# EAGLE design odbiornik (EAGLE 6.4)
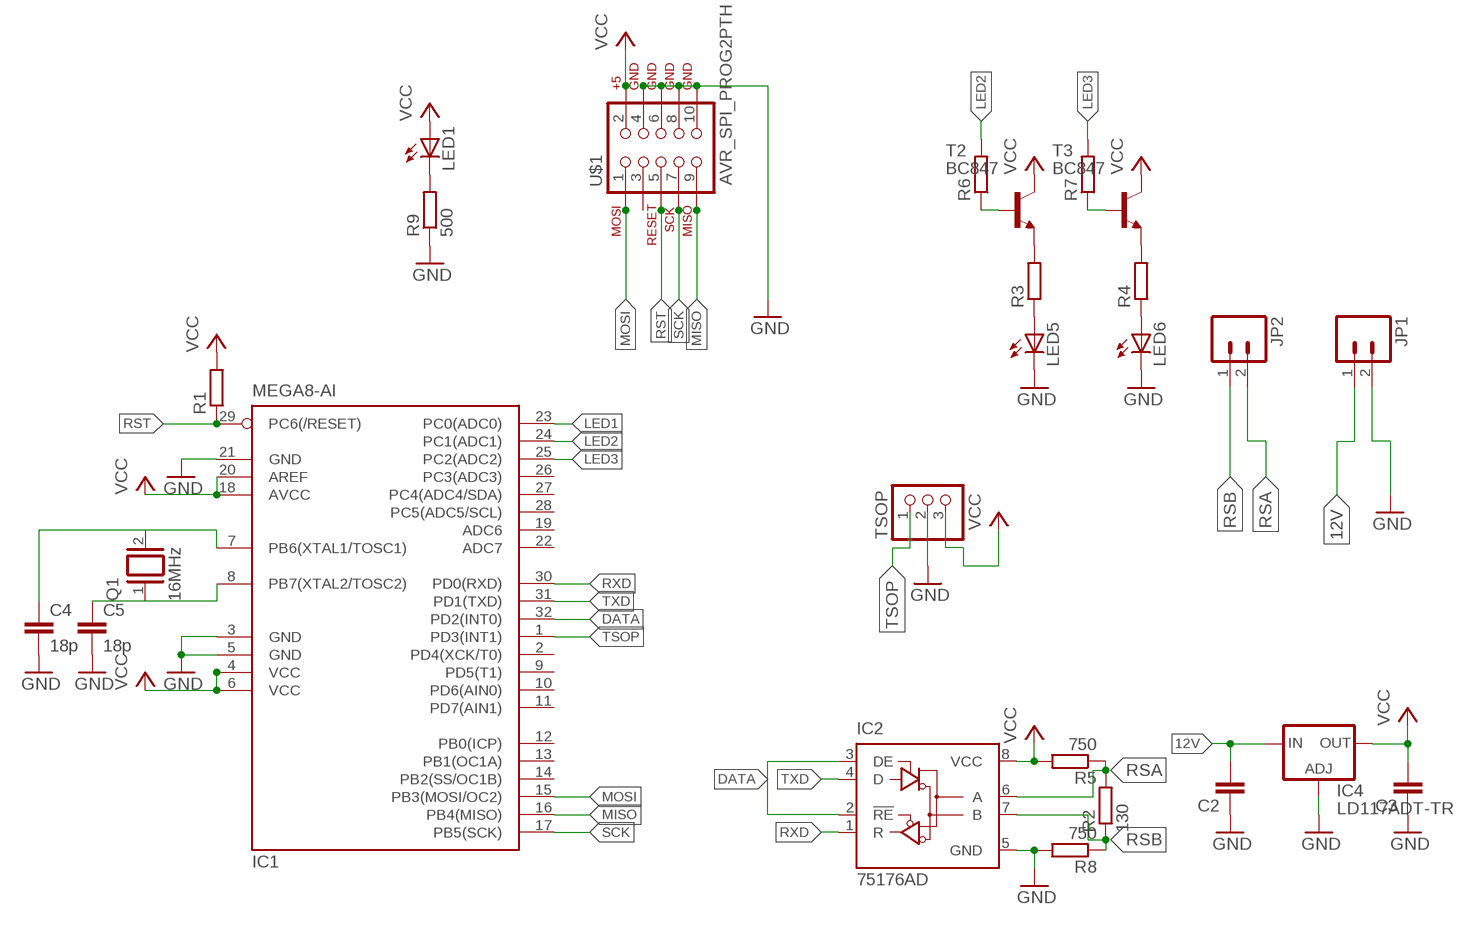
[diagram p0: schematic, sheet 1]

## Parts
C2  C-EUC0805  [C0805]
C3  C-EUC0805  [C0805]
C4  18p  C-EUC0805  [C0805]
C5  18p  C-EUC0805  [C0805]
IC1  MEGA8-AI  [TQFP32-08]
IC2  75176AD  [D_R-PDSO-G8]
IC4  LD117ADT-TR  [DPACK]
JP1  M02LOCK_LONGPADS  [1X02_LOCK_LONGPADS]
JP2  M02LOCK_LONGPADS  [1X02_LOCK_LONGPADS]
LED1  LED1206  [LED-1206]
LED5  LEDSFH480  [SFH480]
LED6  LEDSFH480  [SFH480]
Q1  16MHz  XTAL/S  [QS]
R1  R-EU_R0805  [R0805]
R2  130  R-EU_R0805  [R0805]
R3  R-EU_R0805  [R0805]
R4  R-EU_R0805  [R0805]
R5  750  R-EU_R0805  [R0805]
R6  R-EU_R0805  [R0805]
R7  R-EU_R0805  [R0805]
R8  750  R-EU_R0805  [R0805]
R9  500  R-EU_R0805  [R0805]
T2  BC847  [SOT23]
T3  BC847  [SOT23]
TSOP  PINHD-1X3  [1X03]
U$1  AVR_SPI_PROG2PTH  [AVR_ICSP]

## Nets
12V: C2.2 IC4.3(IN) JP1.1
DATA: IC1.32(PD2(INT0)) IC2.2(!RE) IC2.3(DE)
GND: C2.1 C3.1 C4.2 C5.2 IC1.3(GND) IC1.5(GND) IC1.21(GND) IC2.5(GND) IC4.1(ADJ) JP1.2 LED5.K(C) LED6.K(C) R8.2 R9.1 TSOP.2 U$1.4 U$1.6 U$1.8 U$1.10
LED1: IC1.23(PC0(ADC0))
LED2: IC1.24(PC1(ADC1)) R6.2
LED3: IC1.25(PC2(ADC2)) R7.2
MISO: IC1.16(PB4(MISO)) U$1.9
MOSI: IC1.15(PB3(MOSI/OC2)) U$1.1
N$1: LED1.C R9.2
N$3: LED5.A R3.1
N$4: LED6.A R4.1
N$5: R3.2 T2.2(E)
N$6: R4.2 T3.2(E)
N$8: R6.1 T2.1(B)
N$9: R7.1 T3.1(B)
N$10: C5.1 IC1.8(PB7(XTAL2/TOSC2)) Q1.1
N$11: C4.1 IC1.7(PB6(XTAL1/TOSC1)) Q1.2
RSA: IC2.6(A) JP2.2 R2.2 R5.1
RSB: IC2.7(B) JP2.1 R2.1 R8.1
RST: IC1.29(PC6(/RESET)) R1.1 U$1.5
RXD: IC1.30(PD0(RXD)) IC2.1(R)
SCK: IC1.17(PB5(SCK)) U$1.7
TSOP: IC1.1(PD3(INT1)) TSOP.1
TXD: IC1.31(PD1(TXD)) IC2.4(D)
VCC: C3.2 IC1.4(VCC) IC1.6(VCC) IC1.18(AVCC) IC1.20(AREF) IC2.8(VCC) IC4.4(OUT) LED1.A R1.2 R5.2 T2.3(C) T3.3(C) TSOP.3 U$1.2
Unconnected: IC1.2(PD4(XCK/T0)) IC1.9(PD5(T1)) IC1.10(PD6(AIN0)) IC1.11(PD7(AIN1)) IC1.12(PB0(ICP)) IC1.13(PB1(OC1A)) IC1.14(PB2(SS/OC1B)) IC1.19(ADC6) IC1.22(ADC7) IC1.26(PC3(ADC3)) IC1.27(PC4(ADC4/SDA)) IC1.28(PC5(ADC5/SCL)) U$1.3

## Library data of the parts
C2-C5 = rcl:C-EU: CAPACITOR, European symbol
IC1 = atmel:MEGA8: MICROCONTROLLER 8 Kbytes FLASH, 1 kbytes SRAM, 512 bytes EEPROM, USART, 6-channel 10 bit ADC, 2-channel 8 bit ADC Pin compatible with Atmega48, ATMega88, ATMega168 Source: avr.lbr; MPN: ATMEGA8-16AU; OC_FARNELL: 9171371; OC_NEWARK: 73M8863
IC2 = 751xx:75176A: DIFFERENTIAL BUS TRANSCEIVER Source: http://focus.ti.com/lit/ds/symlink/sn75176a.pdf
IC4 = v-reg:LD117A?*: Low drop fixed and adjustable positive voltage regulators 1 A Source: http://www.st.com/stonline/products/literature/ds/7194/ld1117axx.pdf
JP1 JP2 = SparkFun-Connectors:M02: Header 2 Standard 2-pin 0.1" header. Use with straight break away headers (SKU : PRT-00116), right angle break away headers (PRT-00553), swiss pins (PRT-00743), machine pins (PRT-00117), and female headers (PRT-00115). Molex polarized connector foot print use with SKU : PRT-08233 with associated crimp pins and housings.
LED1 = SparkFun-LED:LED: LEDs Standard schematic elements and footprints for 5mm, 3mm, 1206, and 0603 sized LEDs. 5mm - Spark Fun Electronics SKU : COM-00529 (and others)
LED5 LED6 = led:LED: LED OSRAM: - CHIPLED LG R971, LG N971, LY N971, LG Q971, LY Q971, LO R971, LY R971 LH N974, LH R974 LS Q976, LO Q976, LY Q976 LO Q996 - Hyper CHIPLED LW Q18S LB Q993, LB Q99A, LB R99A - SideLED LS A670, LO A670, LY A670, LG A670, LP A670 LB A673, LV A673, LT A673, LW A673 LH A674 LY A675 LS A676, LA A676, LO A676, LY A676, LW A676 LS A679, LY A679, LG A679 - Hyper Micro SIDELED® LS Y876, LA Y876, LO Y876, LY Y876 LT Y87S - SmartLED LW L88C, LW L88S LB L89C, LB L89S, LG L890 LS L89K, LO L89K, LY L89K LS L896, LA L896, LO L896, LY L896 - TOPLED LS T670, LO T670, LY T670, LG T670, LP T670 LSG T670, LSP T670, LSY T670, LOP T670, LYG T670 LG T671, LOG T671, LSG T671 LB T673, LV T673, LT T673, LW T673 LH T674 LS T676, LA T676, LO T676, LY T676, LB T676, LH T676, LSB T676, LW T676 LB T67C, LV T67C, LT T67C, LS T67K, LO T67K, LY T67K, LW E67C LS E67B, LA E67B, LO E67B, LY E67B, LB E67C, LV E67C, LT E67C LW T67C LS T679, LY T679, LG T679 LS T770, LO T770, LY T770, LG T770, LP T770 LB T773, LV T773, LT T773, LW T773 LH T774 LS E675, LA E675, LY E675, LS T675 LS T776, LA T776, LO T776, LY T776, LB T776 LHGB T686 LT T68C, LB T68C - Hyper Mini TOPLED® LB M676 - Mini TOPLED Santana® LG M470 LS M47K, LO M47K, LY M47K Source: http://www.osram.convergy.de LUXEON: - LUMILED® LXK2-PW12-R00, LXK2-PW12-S00, LXK2-PW14-U00, LXK2-PW14-V00 LXK2-PM12-R00, LXK2-PM12-S00, LXK2-PM14-U00 LXK2-PE12-Q00, LXK2-PE12-R00, LXK2-PE12-S00, LXK2-PE14-T00, LXK2-PE14-U00 LXK2-PB12-K00, LXK2-PB12-L00, LXK2-PB12-M00, LXK2-PB14-N00, LXK2-PB14-P00, LXK2-PB14-Q00 LXK2-PR12-L00, LXK2-PR12-M00, LXK2-PR14-Q00, LXK2-PR14-R00 LXK2-PD12-Q00, LXK2-PD12-R00, LXK2-PD12-S00 LXK2-PH12-R00, LXK2-PH12-S00 LXK2-PL12-P00, LXK2-PL12-Q00, LXK2-PL12-R00 Source: www.luxeon.com KINGBRIGHT: KA-3528ASYC Source: www.kingbright.com
Q1 = special:XTAL/S: CRYSTAL
R1-R9 = rcl:R-EU_: RESISTOR, European symbol
T2 T3 = transistor:BC847: NPN TRANSISTOR
TSOP = pinhead:PINHD-1X3: PIN HEADER
U$1 = SparkFun-Connectors:AVR_SPI_PROG2: AVR 10-pin ICSP Header This is the standard AVR In Circuit Serial Programming header. Minimal, but includes pin one indicator. Works with standard Olimex programmers. Also look for the 6-pin reduced version. Spark Fun Electronics SKU: PRT-00778

## Board
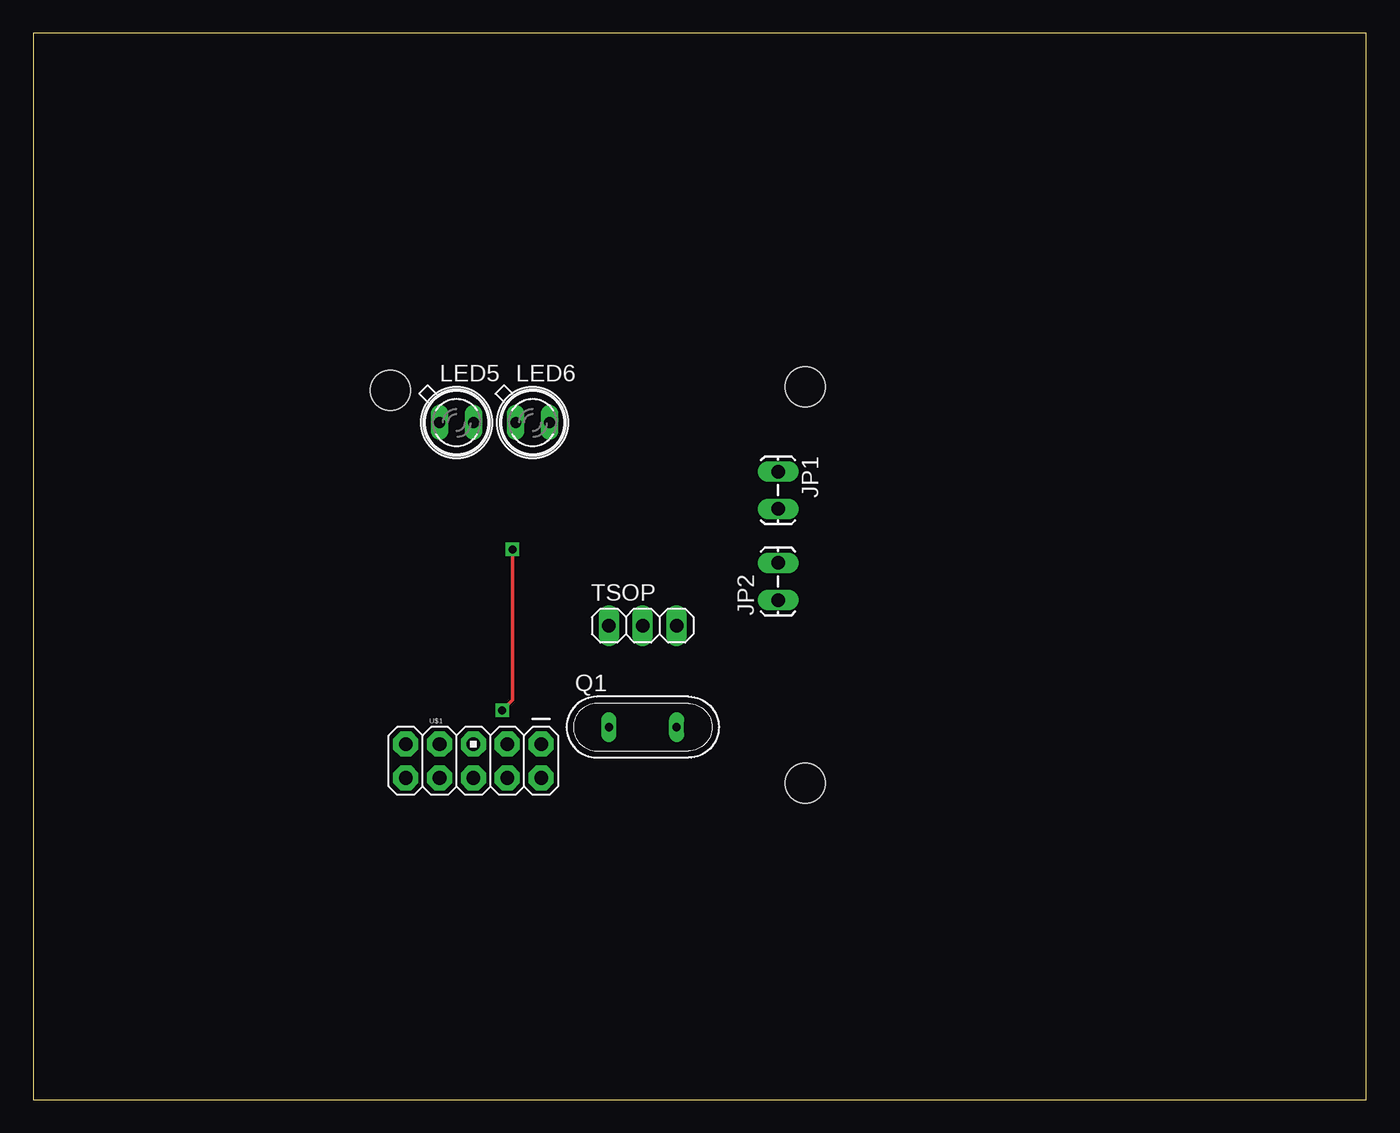
[diagram p1: board, top side]
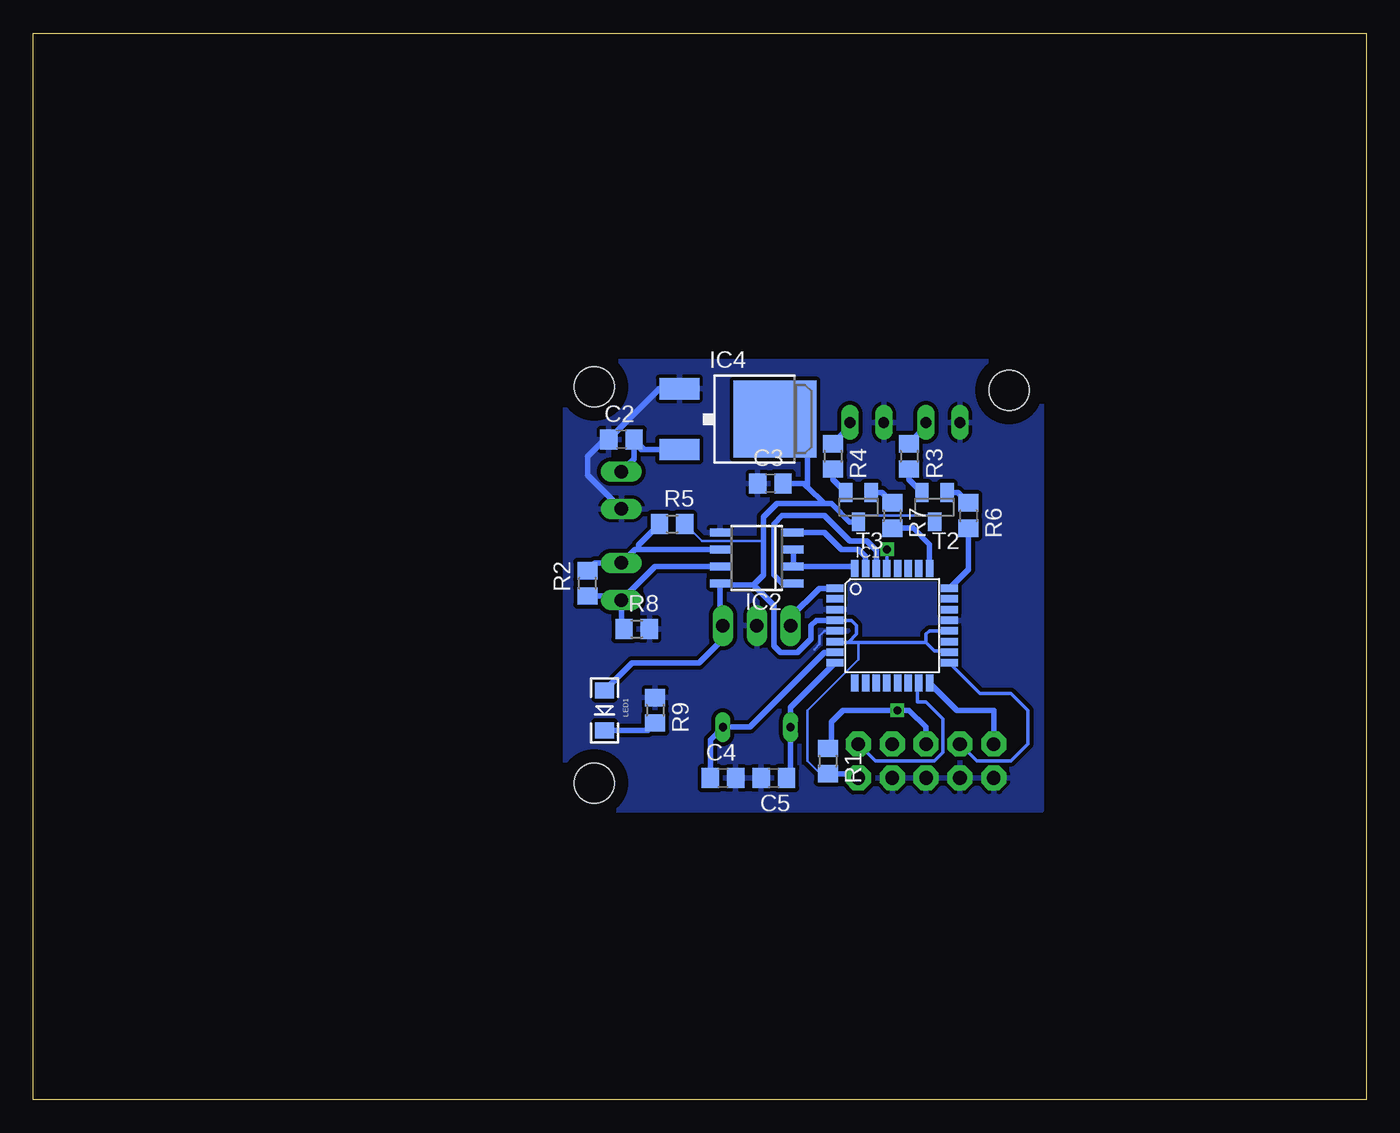
[diagram p2: board, bottom side, seen from below]

Size 100 x 80 mm. Coordinates in mm from the lower left corner, seen from the top.
Outline: 0,0 100,0 100,80 0,80 0,0
Copper layers (1*16): Top 0.035mm / dielectric 1.5mm / Bottom 0.035mm
Design rules "default": minimum track width 10mil, minimum drill 24mil, track to track 8mil, track to pad 8mil, pad to pad 8mil, via to via 8mil, smd to smd 8mil, copper to edge 40mil, drill to drill 8mil, minimum pad ring 10mil, minimum via ring 8mil, stop-mask expansion 4mil, vias tented up to drill 0mil, thermal gap 10mil
Holes 3 mm at 57.91,23.75 26.8,53.21 57.91,53.47

### Footprints (pad centres in the part's own frame; a part is rotated, then mirrored left to right if it is on the bottom)
C0805 = smd 1.3 x 1.5: 1 -0.95,0; 2 0.95,0
TQFP32-08 = smd 1.27 x 0.559: 1 -4.293,2.8; 2 -4.293,2; 3 -4.293,1.2; 4 -4.293,0.4; 5 -4.293,-0.4; 6 -4.293,-1.2; 7 -4.293,-2; 8 -4.293,-2.8; 17 4.293,-2.8; 18 4.293,-2; 19 4.293,-1.2; 20 4.293,-0.4; 21 4.293,0.4; 22 4.293,1.2; 23 4.293,2; 24 4.293,2.8 | smd 0.559 x 1.27: 9 -2.8,-4.293; 10 -2,-4.293; 11 -1.2,-4.293; 12 -0.4,-4.293; 13 0.4,-4.293; 14 1.2,-4.293; 15 2,-4.293; 16 2.8,-4.293; 25 2.8,4.293; 26 2,4.293; 27 1.2,4.293; 28 0.4,4.293; 29 -0.4,4.293; 30 -1.2,4.293; 31 -2,4.293; 32 -2.8,4.293
D_R-PDSO-G8 = smd 0.6 x 1.5: 1 -1.905,-2.75; 2 -0.635,-2.75; 3 0.635,-2.75; 4 1.905,-2.75; 5 1.905,2.75; 6 0.635,2.75; 7 -0.635,2.75; 8 -1.905,2.75
DPACK = smd 1.6 x 3: 1 -2.28,-4.8; 3 2.28,-4.8 | smd 5.8 x 6.2: 4 0,2.38
1X02_LOCK_LONGPADS = drill 1.016 long: 1 -0.127,0; 2 2.667,0
LED-1206 = smd 1.2 x 1.4: A -1.5,0; C 1.5,0
SFH480 = drill 0.813 long: A 1.27,0; K -1.27,0
QS = drill 0.61 long: 1 -2.54,0; 2 2.54,0
R0805 = smd 1.3 x 1.5: 1 -0.95,0; 2 0.95,0
SOT23 = smd 1 x 1.4: 1 -0.95,-1.1; 2 0.95,-1.1; 3 0,1.1
1X03 = drill 1.016 long: 1 -2.54,0; 2 0,0; 3 2.54,0
AVR_ICSP = drill 1.016 pad 1.88 octagon: 1 -1.27,5.08; 2 1.27,5.08; 3 -1.27,2.54; 4 1.27,2.54; 5 -1.27,0; 6 1.27,0; 7 -1.27,-2.54; 8 1.27,-2.54; 9 -1.27,-5.08; 10 1.27,-5.08

### Placement (x,y rotation side)
C2  55.88,49.53 0 bottom
C3  44.7,46.23 0 bottom
C4  48.26,24.13 0 bottom
C5  44.45,24.13 180 bottom
IC1  35.56,35.56 0 bottom
IC2  45.72,40.64 90 bottom
IC4  46.74,51.05 270 bottom
JP1  55.88,46.99 270 top
JP2  55.88,37.59 90 top
LED1  57.15,29.21 270 bottom
LED5  31.75,50.8 0 top
LED6  37.47,50.8 0 top
Q1  45.72,27.94 0 top
R1  40.39,25.4 270 bottom
R2  58.42,38.73 90 bottom
R3  34.29,48.26 270 bottom
R4  40.01,48.26 270 bottom
R5  52.07,43.18 0 bottom
R6  29.84,43.81 270 bottom
R7  35.56,43.81 270 bottom
R8  54.74,35.31 0 bottom
R9  53.34,29.21 270 bottom
T2  32.38,44.45 180 bottom
T3  38.1,44.45 180 bottom
TSOP  45.72,35.56 0 top
U$1  33.02,25.4 270 top

### Tracks (layer width: path | path; a pad name or v marks a point on that pad's centre or on a via)
12V
  Bottom 0.406: 51.61,48.77 IC4.3 54.17,48.77 | 54.17,48.77 C2.2 54.93,48.07 JP1.1 | 54.4,48.77 54.17,48.77
DATA
  Bottom 0.406: IC2.3 IC2.2 38.51,40.01 IC1.32
GND
  Bottom 0.203: IC1.5 40.66,35.16 41.02,34.8 41.02,34.16 41.4,33.78
  Bottom 0.406: 52.05,53.33 IC4.1 53.03,53.33 56.35,50.01 | C2.1 56.35,50.01 | JP1.2 58.42,46.86 58.42,48.26 56.67,50.01 56.35,50.01
  pour Bottom (isolate 0.305): 24.38,55.37 60.07,55.37 60.07,21.72 24.38,21.72
LED2
  Bottom 0.406: R6.2 29.84,39.78 IC1.24
LED3
  Bottom 0.406: R7.2 33.98,42.87 32.76,41.65 IC1.25
MISO
  Bottom 0.406: U$1.9 27.94,29.21 30.7,29.21 IC1.16
MOSI
  Bottom 0.254: U$1.1 36.83,25.4 32.38,25.4 31.75,26.04 31.75,28.57 33.02,29.84 33.66,29.84 33.66,31.17
  Bottom 0.406: 33.66,31.17 IC1.15
N$1
  Bottom 0.406: R9.2 53.89,27.71 LED1.C
N$3
  Bottom 0.406: R3.1 33.02,50.48 LED5.A
N$4
  Bottom 0.406: R4.1 38.73,50.48 LED6.A
N$5
  Bottom 0.406: T2.2 34.29,46.51 R3.2
N$6
  Bottom 0.406: T3.2 40.01,46.51 R4.2
N$8
  Bottom 0.406: R6.1 30.63,45.55 T2.1
N$9
  Bottom 0.406: R7.1 36.34,45.55 T3.1
N$10
  Bottom 0.406: IC1.8 43.18,29.43 Q1.1 43.18,24.13 C5.1
N$11
  Bottom 0.406: C4.1 49.21,26.99 Q1.2 46.23,27.94 40.64,33.53 39.88,33.53 IC1.7
RSA
  Bottom 0.406: R2.2 57.85,40.26 JP2.2 54.86,41.27 54.61,41.27 | 54.61,41.27 IC2.6 | R5.1 54.61,41.59 54.61,41.27
RSB
  Bottom 0.406: JP2.1 56.2,37.78 R2.1 | R8.1 55.88,35.12 JP2.1 | JP2.1 53.34,40.01 IC2.7
RST  (via drill 0.6)
  Top 0.254: v35.18,29.21 35.94,29.97 v35.94,41.27
  Bottom 0.254: v35.94,41.27 35.96,41.26 IC1.29
  Bottom 0.406: U$1.5 33.02,27.94 34.29,29.21 v35.18,29.21 39.24,29.21 40.13,28.32 40.13,26.6 R1.1
RXD
  Bottom 0.406: IC2.1 43.81,38.73 44.45,39.37 44.45,43.18 43.81,43.81 40.64,43.81 38.73,41.91 37.47,41.91 36.76,41.2 IC1.30
SCK
  Bottom 0.254: U$1.7 29.21,25.4 26.67,25.4 25.4,26.67 25.4,29.21 26.67,30.48 28.99,30.48 IC1.17
TSOP
  Bottom 0.406: IC1.1 41.02,38.36 43.18,36.2 TSOP.1
TXD
  Bottom 0.406: IC1.31 37.56,40.73 38.1,41.27 39.37,41.27 40.64,42.55 IC2.4
VCC
  Bottom 0.203: R5.2 49.85,41.91 45.21,41.91 | T3.3 37.63,43.81 32.38,43.81 T2.3 | R1.2 40.96,24.45 41.91,25.4 41.91,29.21 38.1,33.02 38.1,34.29
  Bottom 0.254: IC1.18 31.36,33.66 32.38,33.66 33.02,34.29 | 33.02,34.29 33.02,34.92 32.78,35.16 IC1.20 | IC1.6 39.78,34.29 38.86,34.29 | 38.86,34.29 38.1,34.29 33.02,34.29 | IC1.4 39.83,35.94 38.61,35.94 38.23,35.56 38.23,34.92 38.86,34.29
  Bottom 0.406: TSOP.3 48.47,35.77 | 48.47,35.77 IC2.8 48.34,38.61 45.97,38.61 45.85,38.73 | T3.3 38.78,43.35 40.13,44.7 40.64,44.7 | 40.64,44.7 44.2,44.7 45.21,43.69 45.21,41.91 45.21,39.37 45.85,38.73 | IC1.4 41.26,35.96 41.66,35.56 41.66,34.54 42.67,33.53 43.94,33.53 44.45,34.04 44.45,37.08 45.85,38.48 45.85,38.73 | IC4.4 44.36,50.71 41.91,48.26 41.91,45.97 | 41.91,45.97 40.64,44.7 | C3.2 42.16,46.23 41.91,45.97 | LED1.A 55.09,32.77 50.04,32.77 48.47,34.33 48.47,35.77 | R1.2 38.42,24.45 U$1.2